# EAGLE design PET_1541_Ada (EAGLE 9.6.2)
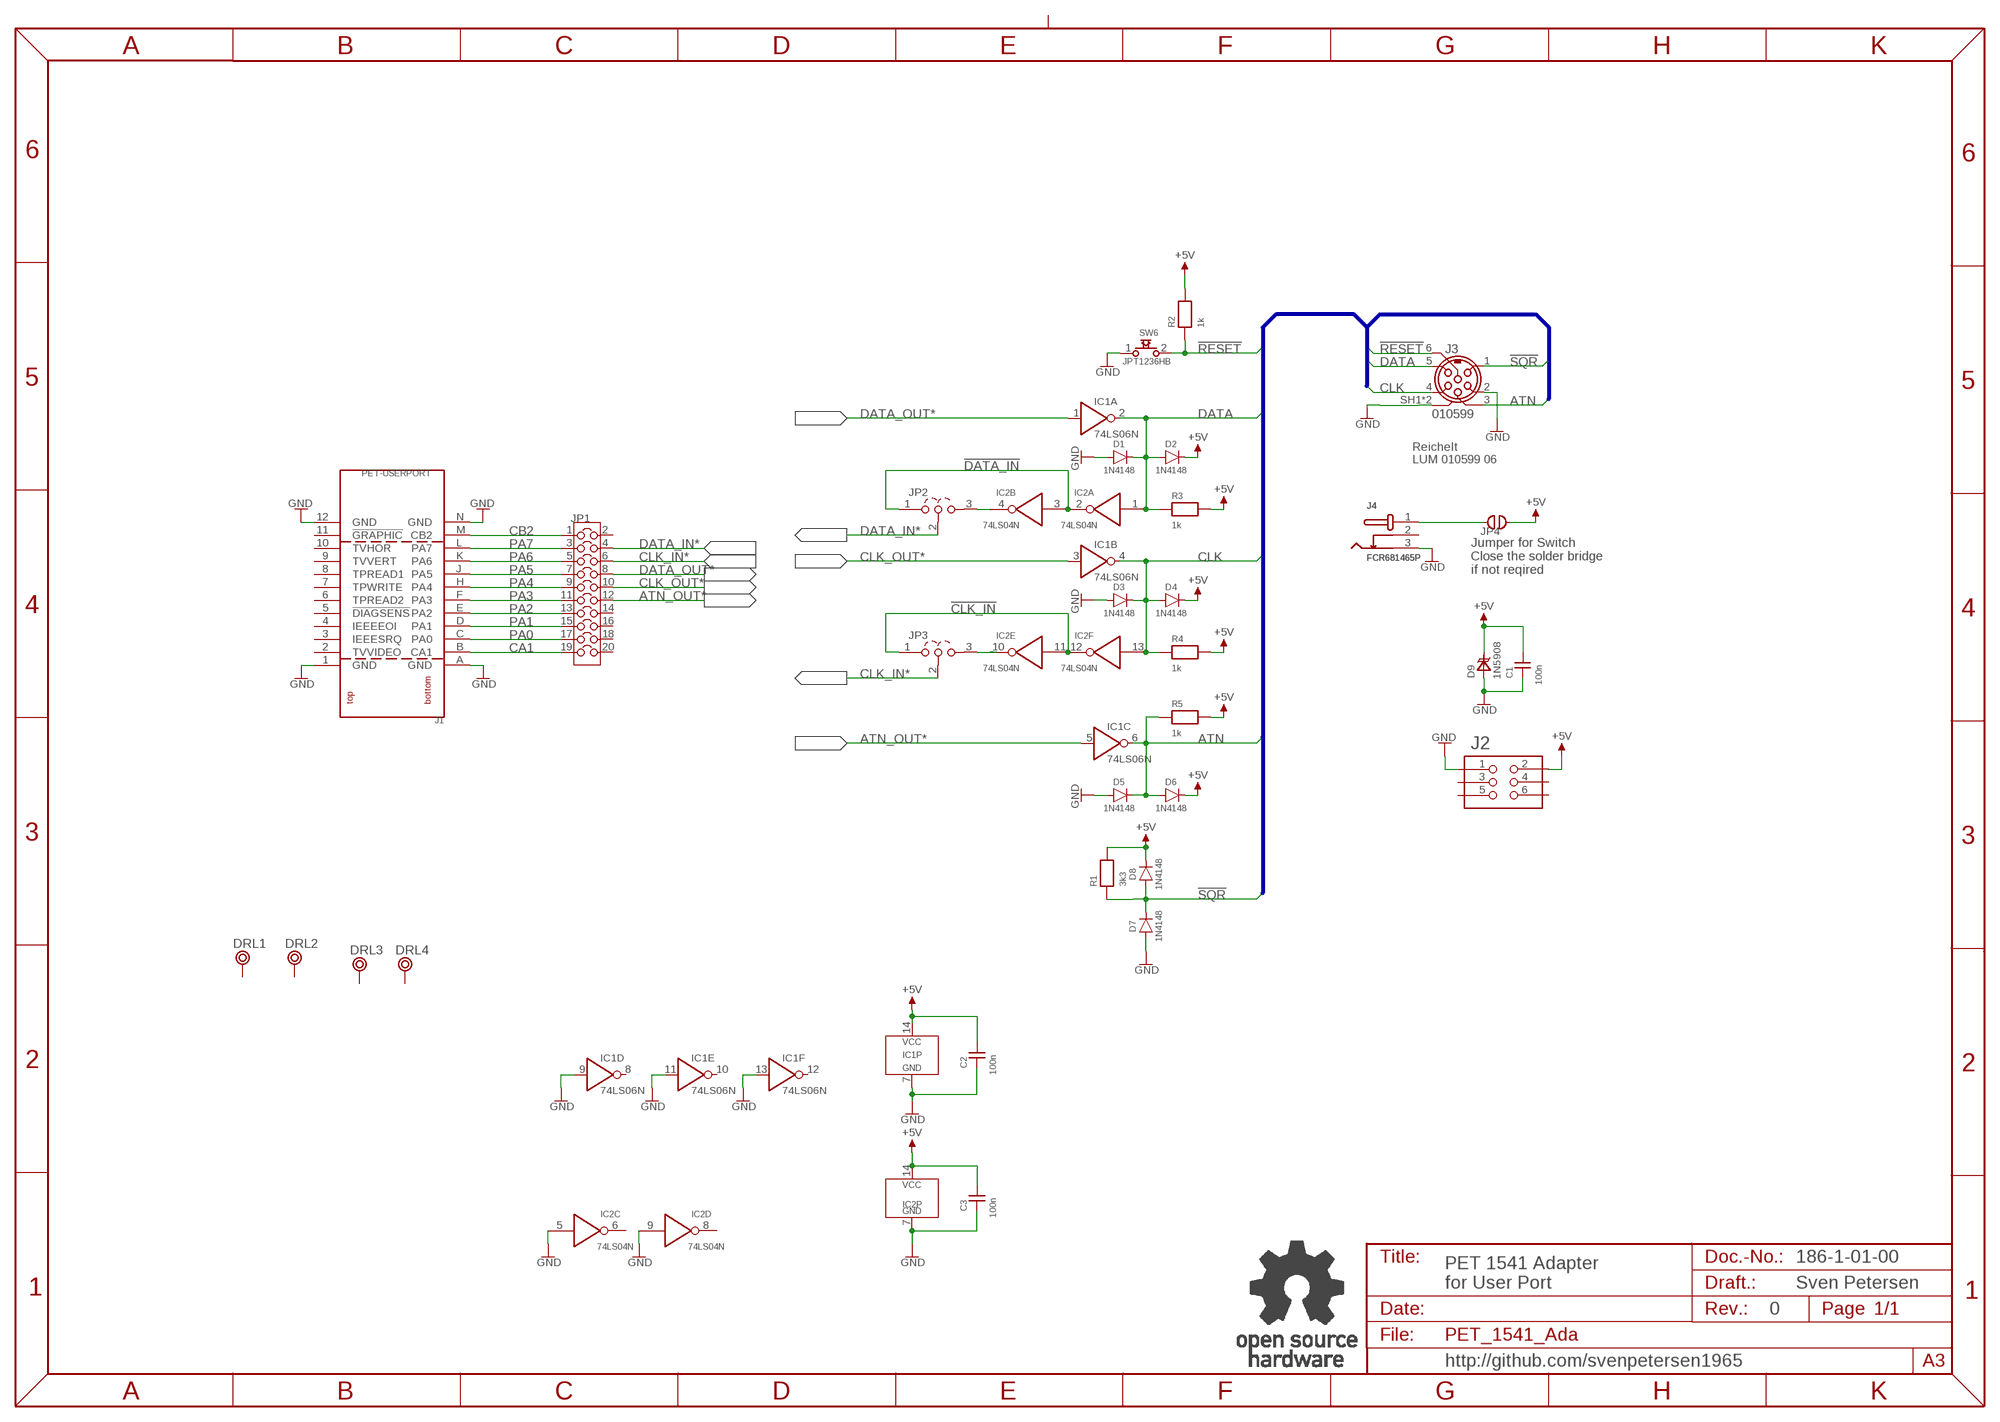
[diagram p0: schematic, sheet 1]

## Parts
C1  100n  CAP01  [C-2,5]
C2  100n  CAP01  [C-2,5]
C3  100n  CAP01  [C-2,5]
D1  1N4148  1N41480.3"  [DO-35/3]
D2  1N4148  1N41480.3"  [DO-35/3]
D3  1N4148  1N41480.3"  [DO-35/3]
D4  1N4148  1N41480.3"  [DO-35/3]
D5  1N4148  1N41480.3"  [DO-35/3]
D6  1N4148  1N41480.3"  [DO-35/3]
D7  1N4148  1N41480.3"  [DO-35/3]
D8  1N4148  1N41480.3"  [DO-35/3]
D9  1N5908  [CB429]
DRL1  BOHR3,5  [BOHR3,5]
DRL2  BOHR3,5  [BOHR3,5]
DRL3  BOHR3,5  [BOHR3,5]
DRL4  BOHR3,5  [BOHR3,5]
IC1  74LS06N  7406N  [DIL-14]
IC2  74LS04N  7404DIL  [DIL-14]
J1  PET-USERPORT  [USERPORT]
J2  2X03WV  [2X03WV]
J3  010599  [010599]
J4  FCR681465P  [FCR681465P]
JP1  COMBI_2X10  [COMBI-10X2]
JP2  COMBI-3P  [COMBI-3P]
JP3  COMBI-3P  [COMBI-3P]
JP4  COMBI_2P  [COMBI-2P]
R1  3k3  RES04  [R-10]
R2  1k  RES04  [R-10]
R3  1k  RES04  [R-10]
R4  1k  RES04  [R-10]
R5  1k  RES04  [R-10]
SW6  JPT1236HB  [JTP_1236HB]
U$2  OPEN_SOURCE_HW  [OPENHW]

## Nets
!CLK_IN: IC2.11(E:I) IC2.12(F:O) JP3.1
!DATA_IN: IC2.2(A:O) IC2.3(B:I) JP2.1
!RESET: J3.6 R2.1 SW6.2
!SQR: D7.K D8.A J3.1 R1.1
+5V: C1.2 C2.2 C3.2 D2.K D4.K D6.K D8.K D9.K IC1.14(P:VCC) IC2.14(P:VCC) J2.2 JP4.2 R1.2 R2.2 R3.2 R4.2 R5.2
ATN: D5.K D6.A IC1.6(C:O) J3.3 R5.1
ATN_OUT*: IC1.5(C:I) JP1.12
CA1: J1.B(CA1) JP1.19
CB2: J1.M(CB2) JP1.1
CLK: D3.K D4.A IC1.4(B:O) IC2.13(F:I) J3.4 R4.1
CLK_IN: IC2.10(E:O) JP3.3
CLK_IN*: JP1.6 JP3.2
CLK_OUT*: IC1.3(B:I) JP1.10
DATA: D1.K D2.A IC1.2(A:O) IC2.1(A:I) J3.5 R3.1
DATA_IN: IC2.4(B:O) JP2.3
DATA_IN*: JP1.4 JP2.2
DATA_OUT*: IC1.1(A:I) JP1.8
GND: C1.1 C2.1 C3.1 D1.A D3.A D5.A D7.A D9.A IC1.7(P:GND) IC1.9(D:I) IC1.11(E:I) IC1.13(F:I) IC2.5(C:I) IC2.7(P:GND) IC2.9(D:I) J1.1(GND) J1.12(GND) J1.A(GND) J1.N(GND) J2.1 J3.2 J3.SH1(SH) J3.SH2(SH) J4.3 SW6.1
N$7: J4.1 JP4.1
PA0: J1.C(PA0) JP1.17
PA1: J1.D(PA1) JP1.15
PA2: J1.E(PA2) JP1.13
PA3: J1.F(PA3) JP1.11
PA4: J1.H(PA4) JP1.9
PA5: J1.J(PA5) JP1.7
PA6: J1.K(PA6) JP1.5
PA7: J1.L(PA7) JP1.3
Unconnected: DRL1.P$1 DRL2.P$1 DRL3.P$1 DRL4.P$1 IC1.8(D:O) IC1.10(E:O) IC1.12(F:O) IC2.6(C:O) IC2.8(D:O) J1.2(TVVIDEO) J1.3(IEEESRQ) J1.4(IEEEEOI) J1.5(!DIAGSENS) J1.6(TPREAD2) J1.7(TPWRITE) J1.8(TPREAD1) J1.9(TVVERT) J1.10(TVHOR) J1.11(!GRAPHIC) J2.3 J2.4 J2.5 J2.6 J4.2 JP1.2 JP1.14 JP1.16 JP1.18 JP1.20

## Buses
IEC:!RESET,!SQR,ATN,CLK,DATA

## Notes on the sheet
- Reichelt
  LUM 010599 06
- Jumper for Switch
  Close the solder bridge
  if not reqired
- 186-1-01-00
- PET 1541 Adapter
  for User Port
- Sven Petersen
- 0
- http://github.com/svenpetersen1965

## Library data of the parts
C1-C3 = DISCRETE:CAP01
D1-D8 = Dioden:1N4148
D9 = ST:1N5908
DRL1-DRL4 = Mech_Bohr:BOHR3,5
IC1 = 74XXsmd:7406
IC2 = 74XX:7404
J1 = Commodore:PET-USERPORT
J2 = PINHEAD:2X03WV
J3 = Lumberg:010599
J4 = Cliff:FCR681465P
JP1 = Cutpad:COMBI_2X10
JP2 JP3 = Cutpad:COMBI-3P
JP4 = Cutpad:COMBI_2P
R1-R5 = DISCRETE:RES04
SW6 = Namae_Electronics:JPT1236HB
U$2 = Logo:OPEN_SOURCE_HW

## Board
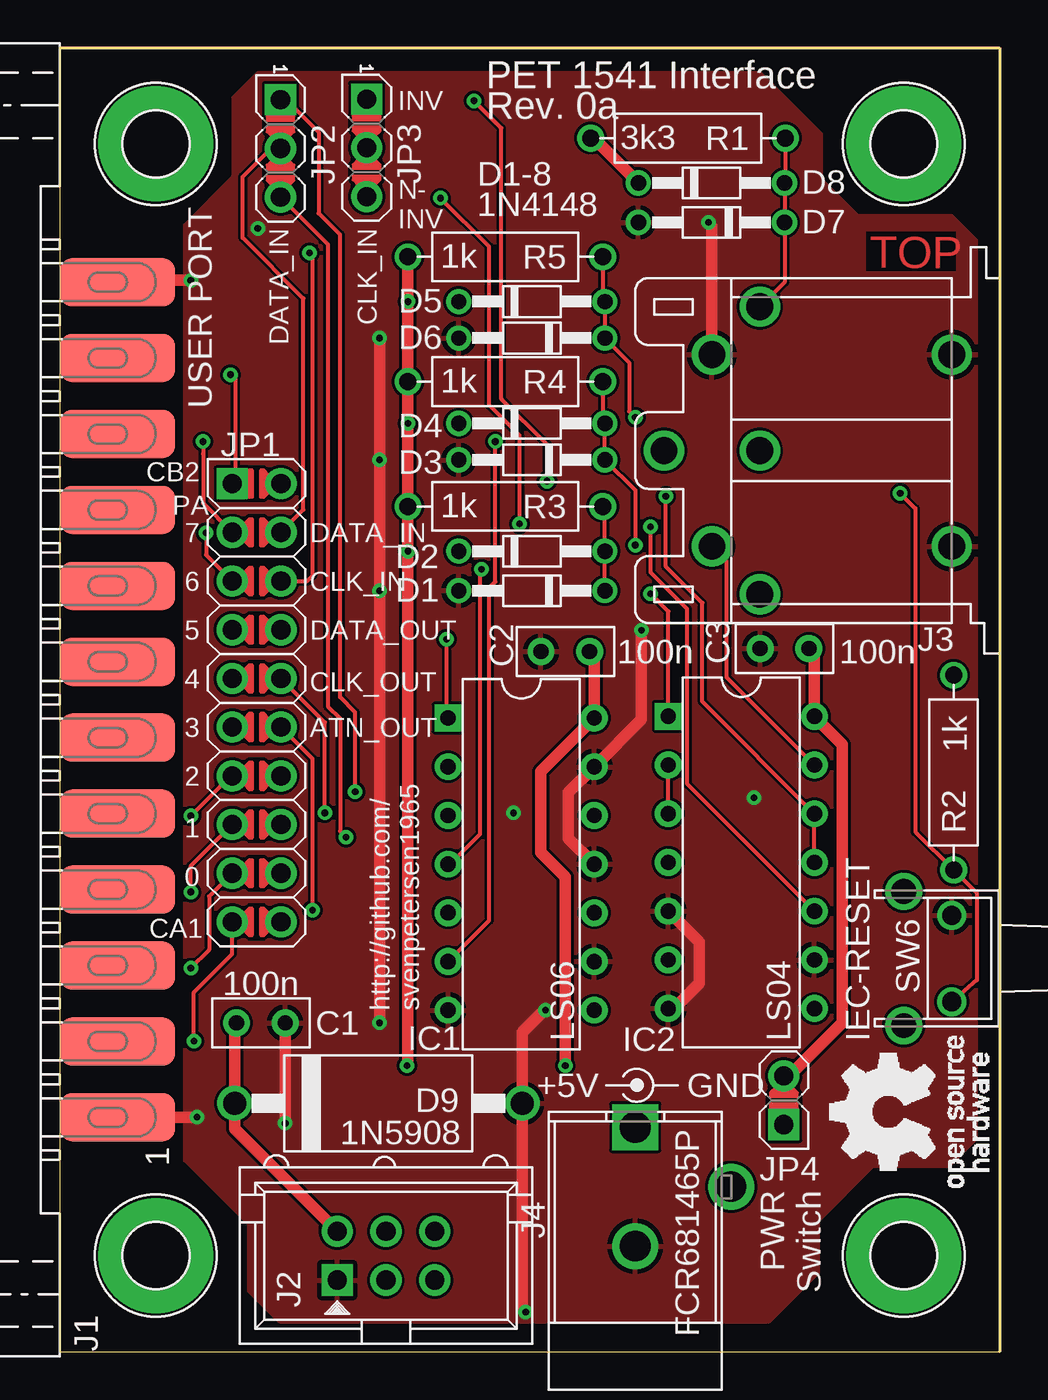
[diagram p1: board, top side]
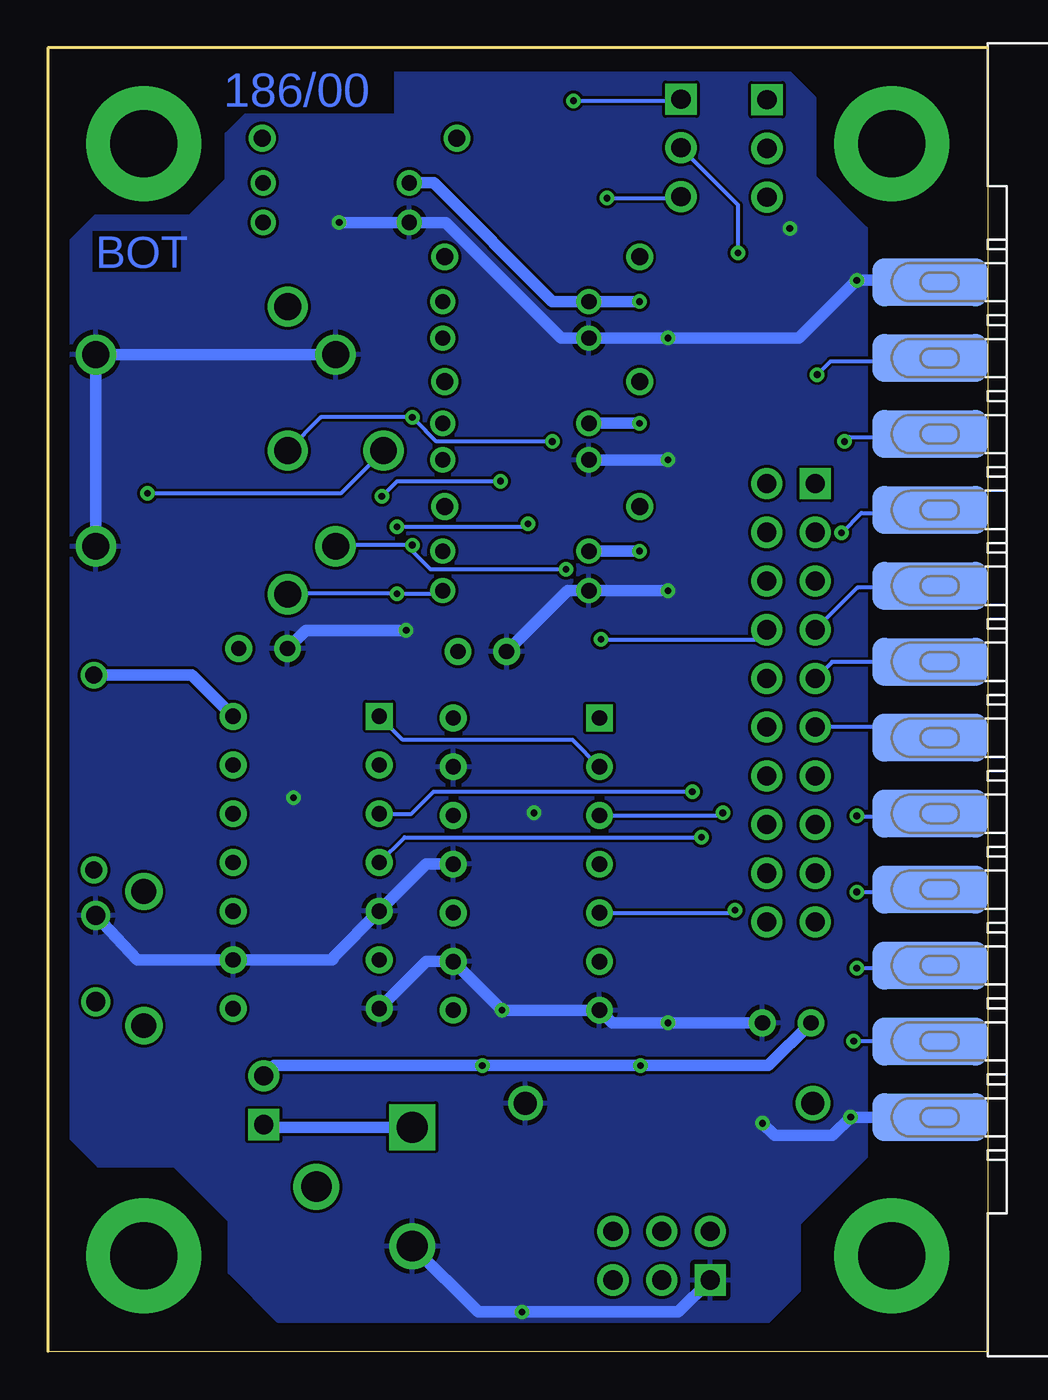
[diagram p2: board, bottom side, seen from below]

Size 49 x 68 mm. Coordinates in mm from the lower left corner, seen from the top.
Outline: 0,0 49,0 49,68 0,68 0,0
Copper layers (1*16): Top 0.035mm / dielectric 1.5mm / Bottom 0.035mm
Design rules "default *": minimum track width 6mil, minimum drill 0.35mm, track to track 6mil, track to pad 6mil, pad to pad 6mil, via to via 6mil, smd to smd 6mil, copper to edge 40mil, drill to drill 6mil, minimum pad ring 10mil, minimum via ring 8mil, stop-mask expansion 4mil, vias tented up to drill 25mil, thermal gap 10mil
bRestrict: 2 lines

### Footprints (pad centres in the part's own frame; a part is rotated, then mirrored left to right if it is on the bottom)
C-2,5 = drill 0.8 pad 1.397: 1 -1.27,0; 2 1.27,0
DO-35/3 = drill 0.8: A -3.81,0; K 3.81,0
CB429 = drill 1.2: A -7.5,0; K 7.5,0
BOHR3,5 = drill 3.5 pad 6: P$1 0,0
DIL-14 = drill 0.8 pad 1.397 square: 1 -7.62,-3.81 | drill 0.8 pad 1.397: 2 -5.08,-3.81; 3 -2.54,-3.81; 4 0,-3.81; 5 2.54,-3.81; 6 5.08,-3.81; 7 7.62,-3.81; 8 7.62,3.81; 9 5.08,3.81; 10 2.54,3.81; 11 0,3.81; 12 -2.54,3.81; 13 -5.08,3.81; 14 -7.62,3.81
USERPORT = smd 2.5 x 6: 1 -21.78,-3; 2 -17.82,-3; 3 -13.86,-3; 4 -9.9,-3; 5 -5.94,-3; 6 -1.98,-3; 7 1.98,-3; 8 5.94,-3; 9 9.9,-3; 10 13.86,-3; 11 17.82,-3; 12 21.78,-3 | smd 2.5 x 6 bottom: A -21.78,-3; B -17.82,-3; C -13.86,-3; D -9.9,-3; E -5.94,-3; F -1.98,-3; H 1.98,-3; J 5.94,-3; K 9.9,-3; L 13.86,-3; M 17.82,-3; N 21.78,-3
2X03WV = drill 1 pad 1.626 square: 1 -2.54,-1.27 | drill 1 pad 1.626: 2 -2.54,1.27; 3 0,-1.27; 4 0,1.27; 5 2.54,-1.27; 6 2.54,1.27
010599 = drill 1.4: 1 10,-7.5; 2 12.5,-5; 3 10,0; 4 12.5,5; 5 10,7.5; 6 15,0; SH1 0,5; SH2 0,-5
FCR681465P = drill 1.6 square: 1 0,13.7 | drill 1.6: 2 5,10.6; 3 0,7.5
COMBI-10X2 = drill 1 pad 1.626 square: 1 -1.27,11.43 | drill 1 pad 1.626: 2 1.27,11.43; 3 -1.27,8.89; 4 1.27,8.89; 5 -1.27,6.35; 6 1.27,6.35; 7 -1.27,3.81; 8 1.27,3.81; 9 -1.27,1.27; 10 1.27,1.27; 11 -1.27,-1.27; 12 1.27,-1.27; 13 -1.27,-3.81; 14 1.27,-3.81; 15 -1.27,-6.35; 16 1.27,-6.35; 17 -1.27,-8.89; 18 1.27,-8.89; 19 -1.27,-11.43; 20 1.27,-11.43
COMBI-3P = drill 1 pad 1.626 square: 1 -2.54,0 | drill 1 pad 1.626: 2 0,0; 3 2.54,0
COMBI-2P = drill 1 pad 1.626 square: 1 -1.27,0 | drill 1 pad 1.626: 2 1.27,0
R-10 = drill 0.889 pad 1.397: 1 -5.08,0; 2 5.08,0
JTP_1236HB = drill 1: 1 2.25,0; 2 -2.25,0 | drill 1.3: CS1 3.5,2.5; CS2 -3.5,2.5

### Placement (x,y rotation side)
C1  10.48,17.14 180 top
C2  26.35,36.51 0 top
C3  37.78,36.67 0 top
D1  24.61,39.69 0 top
D2  24.61,41.75 180 top
D3  24.61,46.51 0 top
D4  24.61,48.42 180 top
D5  24.61,52.86 0 top
D6  24.61,54.77 180 top
D7  33.97,58.9 0 top
D8  33.97,60.96 180 top
D9  16.61,12.95 180 top
DRL1  5,5 0 top
DRL2  44,5 0 top
DRL3  44,63 0 top
DRL4  5,63 0 top
IC1  24.05,25.43 270 top
IC2  35.53,25.51 270 top
J1  0,34 90 top
J2  17,5 0 top
J3  46.5,47 180 top
J4  30,-2 0 top
JP1  10.25,33.84 0 top
JP2  11.51,62.76 270 top
JP3  15.99,62.79 270 top
JP4  37.75,13.11 90 top
R1  32.75,63.3 180 top
R2  46.6,30.2 90 top
R3  23.23,44.08 180 top
R4  23.23,50.59 180 top
R5  23.23,57.1 180 top
SW6  46.5,20.5 90 top
U$2  48.42,8.57 90 top
U$47  [2LAYER]  42.23,56.52 0 top
U$48  [PCB-TITLE/]  -0.16,83.66 0 top  (outside the outline)

### Tracks (layer width: path | path; a pad name or v marks a point on that pad's centre or on a via)
!CLK_IN  (via drill 0.35)
  Top 0.203: IC2.11 IC2.12 33.5,33.9 33.5,39.05 31.59,40.96 v31.59,44.61 | v25.4,45.4 25.4,47.31 23.02,49.69 23.02,63.82 v21.59,65.25
  Bottom 0.203: v31.59,44.61 30.8,45.4 v25.4,45.4 | v21.59,65.25 16.08,65.25 JP3.1
!DATA_IN  (via drill 0.35)
  Top 0.203: JP2.1 11.71,65.09 12.01,65.09 13.49,63.6 13.49,59.37 14.61,58.26 14.61,34.13 15.4,33.34 v15.4,29.21 | IC2.3 IC2.2
  Bottom 0.203: IC2.3 30.05,28.05 28.89,29.21 v15.4,29.21
!RESET  (via drill 0.35)
  Top 0.203: v43.81,44.77 44.61,43.97 44.61,27.11 R2.1 47.81,23.91 47.81,19.39 SW6.2
  Bottom 0.203: J3.6 33.73,44.77 v43.81,44.77
!SQR
  Top 0.203: R1.1 37.83,61.01 D8.A D7.K 37.78,55.78 J3.1
+5V  (via drill 0.35)
  Top 0.61: C1.2 9.11,17.05 D9.K 9.11,11.62 J2.2 | v26.35,14.92 26.35,24.77 25.08,26.04 25.08,30.27 IC1.14 27.86,36.27 C2.2 | JP4.2 38.03,14.38 40.8,17.14 40.8,31.68 IC2.14 39.34,36.38 C3.2 | v18.1,14.92 18.15,14.97 v18.15,41.75 R3.2 v18.15,48.42 R4.2 v18.15,54.77 R5.2 | D8.K 27.83,63.3 R1.2
  Bottom 0.61: C1.2 11.43,14.92 v18.1,14.92 v26.35,14.92 37.21,14.92 JP4.2 | IC2.14 41.49,35.28 R2.2 | v18.15,54.77 D6.K 22.7,54.77 28.89,60.96 D8.K | v18.15,54.77 18.1,54.77 v18.15,54.77 | D4.K v18.15,48.42 | v18.15,48.42 18.1,48.42 v18.15,48.42 | D2.K v18.15,41.75 | v18.15,41.75 18.1,41.75 v18.15,41.75
ATN  (via drill 0.35)
  Top 0.203: R5.1 28.31,54.88 D6.A D5.K 29.69,51.59 29.69,49.05 v30,48.74 | IC1.6 22.38,22.49 22.38,39.85 22.7,40.16 v22.7,47.47
  Bottom 0.203: J3.3 34.76,48.74 v30,48.74 29.32,48.06 29.32,48.04 28.75,47.47 v22.7,47.47
ATN_OUT*  (via drill 0.35)
  Top 0.203: v13.18,23.02 13.18,30.92 JP1.12
  Bottom 0.203: IC1.5 13.31,22.89 v13.18,23.02
CA1  (via drill 0.35)
  Top 0.203: v6.99,16.19 6.99,18.73 8.98,20.73 JP1.19
  Bottom 0.203: J1.B v6.99,16.18 v6.99,16.19
CB2  (via drill 0.35)
  Top 0.203: v8.89,50.96 9.14,50.71 9.14,45.43 JP1.1
  Bottom 0.203: J1.M 3.16,51.66 8.19,51.66 v8.89,50.96
CLK  (via drill 0.35)
  Top 0.203: R4.1 28.31,48.53 D4.A D3.K 30,44.93 v30,42.07 | IC1.4 20.34,25.43 21.91,26.99 21.91,40.8 v21.98,40.8 | IC2.13 34.77,35.17 34.77,41.23 J3.4
  Bottom 0.203: J3.4 33.93,42.07 v30,42.07 30,41.75 29.05,40.8 26.99,40.8 v21.98,40.8
CLK_IN  (via drill 0.35)
  Top 0.203: IC2.10 32.7,29.61 32.7,38.73 30.8,40.64 v30.8,43.02 | v23.97,43.18 23.97,47.78 22.38,49.37 22.38,57.63 v19.84,60.17
  Bottom 0.203: v30.8,43.02 24.13,43.02 v23.97,43.18 | v19.84,60.17 16.08,60.17 JP3.3
CLK_IN*  (via drill 0.35)
  Top 0.203: JP1.6 12.89,40.19 13.18,40.48 13.18,57.15 v13.02,57.31
  Bottom 0.203: v13.02,57.31 13.02,59.81 JP3.2
CLK_OUT*  (via drill 0.35)
  Top 0.203: v13.81,28.1 13.81,32.82 JP1.10
  Bottom 0.203: IC1.3 13.95,27.96 v13.81,28.1
DATA  (via drill 0.35)
  Top 0.203: D1.K D2.A 28.42,43.98 R3.1 | IC2.1 31.72,38.6 v30.8,39.53
  Bottom 0.203: IC1.2 21.65,31.91 30.5,31.91 IC2.1 | D1.K 28.57,39.53 v30.8,39.53 36.47,39.53 J3.5
DATA_IN  (via drill 0.35)
  Top 0.203: JP2.3 13.97,57.75 13.97,33.66 14.61,33.02 14.61,27.15 v14.92,26.83
  Bottom 0.203: IC2.4 30.41,26.83 v14.92,26.83
DATA_IN*
  Top 0.203: JP1.4 12.7,43.91 12.7,54.93 9.53,58.1 9.53,61.28 11,62.76 JP2.2
DATA_OUT*  (via drill 0.35)
  Top 0.203: IC1.1 20.16,33.13 v20.16,37.15
  Bottom 0.203: v20.16,37.15 12.03,37.15 JP1.8
GND  (via drill 0.35)
  Top 0.61: IC2.5 33.34,21.36 33.34,19.21 32.02,17.89 IC2.7 | IC1.11 26.51,26.78 26.51,29.15 IC1.13 30.32,32.96 v30.32,37.62 | v24.29,2.06 24.11,2.24 D9.A 24.11,16.65 25.27,17.8 v25.32,17.8 | v7.14,12.22 J1.A | v11.75,11.91 C1.1 | v16.67,17.14 v16.67,39.69 v16.67,46.51 v16.67,52.86 | J3.2 34,58.71 v33.81,58.9 | v6.83,55.88 3.1,55.88 J1.N
  Bottom 0.61: SW6.1 44.35,20.43 IC2.9 34.18,20.43 34.13,20.48 34.13,20.57 IC2.5 29.27,25.43 IC1.11 | IC2.7 29.27,20.34 IC1.9 v25.32,17.8 IC1.7 19.58,17.14 v16.67,17.14 C1.1 | J2.1 16.13,2.06 v24.29,2.06 26.56,2.06 J4.3 | J1.A v7.14,12.22 8.1,11.27 11.11,11.27 v11.75,11.91 | v16.67,39.69 D1.A 21.91,39.69 C2.1 | v16.67,46.51 D3.A | J3.SH1 J3.SH2 J3.2 | v33.81,58.9 D7.A 28.26,58.9 22.23,52.86 D5.A v16.67,52.86 9.84,52.86 v6.83,55.88 3.1,55.88 J1.N | v30.32,37.62 35.56,37.62 C3.1
  other vias: 23.65,28.1 36.2,28.89 10.32,58.58
  pour Top: 6.51,10 9.84,6.67 9.84,3.17 11.43,1.59 36.99,1.59 39.53,4.13 39.53,6.83 42.39,9.68 46.35,9.68 47.78,11.11 47.78,57.94 46.51,59.21 41.59,59.21 39.69,61.12 39.69,63.5 36.51,66.67 10.32,66.67 9.05,65.41 9.05,61.28 6.51,58.74
  pour Bottom: 6.35,10.16 9.84,6.67 9.84,3.17 11.43,1.59 36.99,1.59 39.53,4.13 39.53,6.83 42.39,9.68 46.35,9.68 47.78,11.11 47.78,57.94 46.51,59.21 41.59,59.21 39.69,61.12 39.69,63.5 36.51,66.67 10.32,66.67 9.05,65.41 9.05,61.28 6.35,58.58
N$7
  Bottom 0.61: J4.1 37.61,11.7 JP4.1
PA0  (via drill 0.35)
  Top 0.203: v6.83,20 7.78,20.95 7.78,23.75 JP1.17
  Bottom 0.203: v6.83,20 3.14,20 J1.C
PA1  (via drill 0.35)
  Top 0.203: v6.83,23.97 6.83,25.33 JP1.15
  Bottom 0.203: v6.83,23.97 3.13,23.97 J1.D
PA2  (via drill 0.35)
  Top 0.203: v6.83,27.94 8.92,30.03 JP1.13
  Bottom 0.203: J1.E 3.16,27.9 6.79,27.9 v6.83,27.94
PA3
  Bottom 0.203: J1.F 3.55,32.57 JP1.11
PA4
  Bottom 0.203: J1.H 8.12,35.98 JP1.9
PA5
  Bottom 0.203: J1.J 3.09,39.85 6.79,39.85 JP1.7
PA6  (via drill 0.35)
  Top 0.203: v7.62,42.7 7.62,41.55 JP1.5
  Bottom 0.203: J1.K 3.16,43.74 6.58,43.74 v7.62,42.7
PA7  (via drill 0.35)
  Top 0.203: v7.46,47.47 7.46,46.83 7.46,44.25 JP1.3
  Bottom 0.203: J1.L 3.16,47.7 7.23,47.7 v7.46,47.47

### Text on the board
Bottom: 186/00
tPlace: INV | N- / INV | DATA_IN | CLK_IN | USER PORT | CB2 | PA | 7 | DATA_IN | 6 | CLK_IN | 5 | DATA_OUT | 4 | CLK_OUT | 3 | ATN_OUT | 2 | 1 | 0 | CA1 | +5V | GND | 1 | PWR / Switch
tNames: PET 1541 Interface | Rev. 0a | 3k3 | D1-8 | 1N4148 | 1k | 1k | 1k | 100n | 100n | 1k | 100n | http://github.com/ / svenpetersen1965 | LS06 | LS04 | IEC-RESET | 1N5908 | FCR681465P
Document: 186-2-01-00 | Sven Petersen / 2021 | 35µm | 2 | 0